# EAGLE design S7G2_footprint_with_caps_v1p0 (EAGLE 9.5.0)
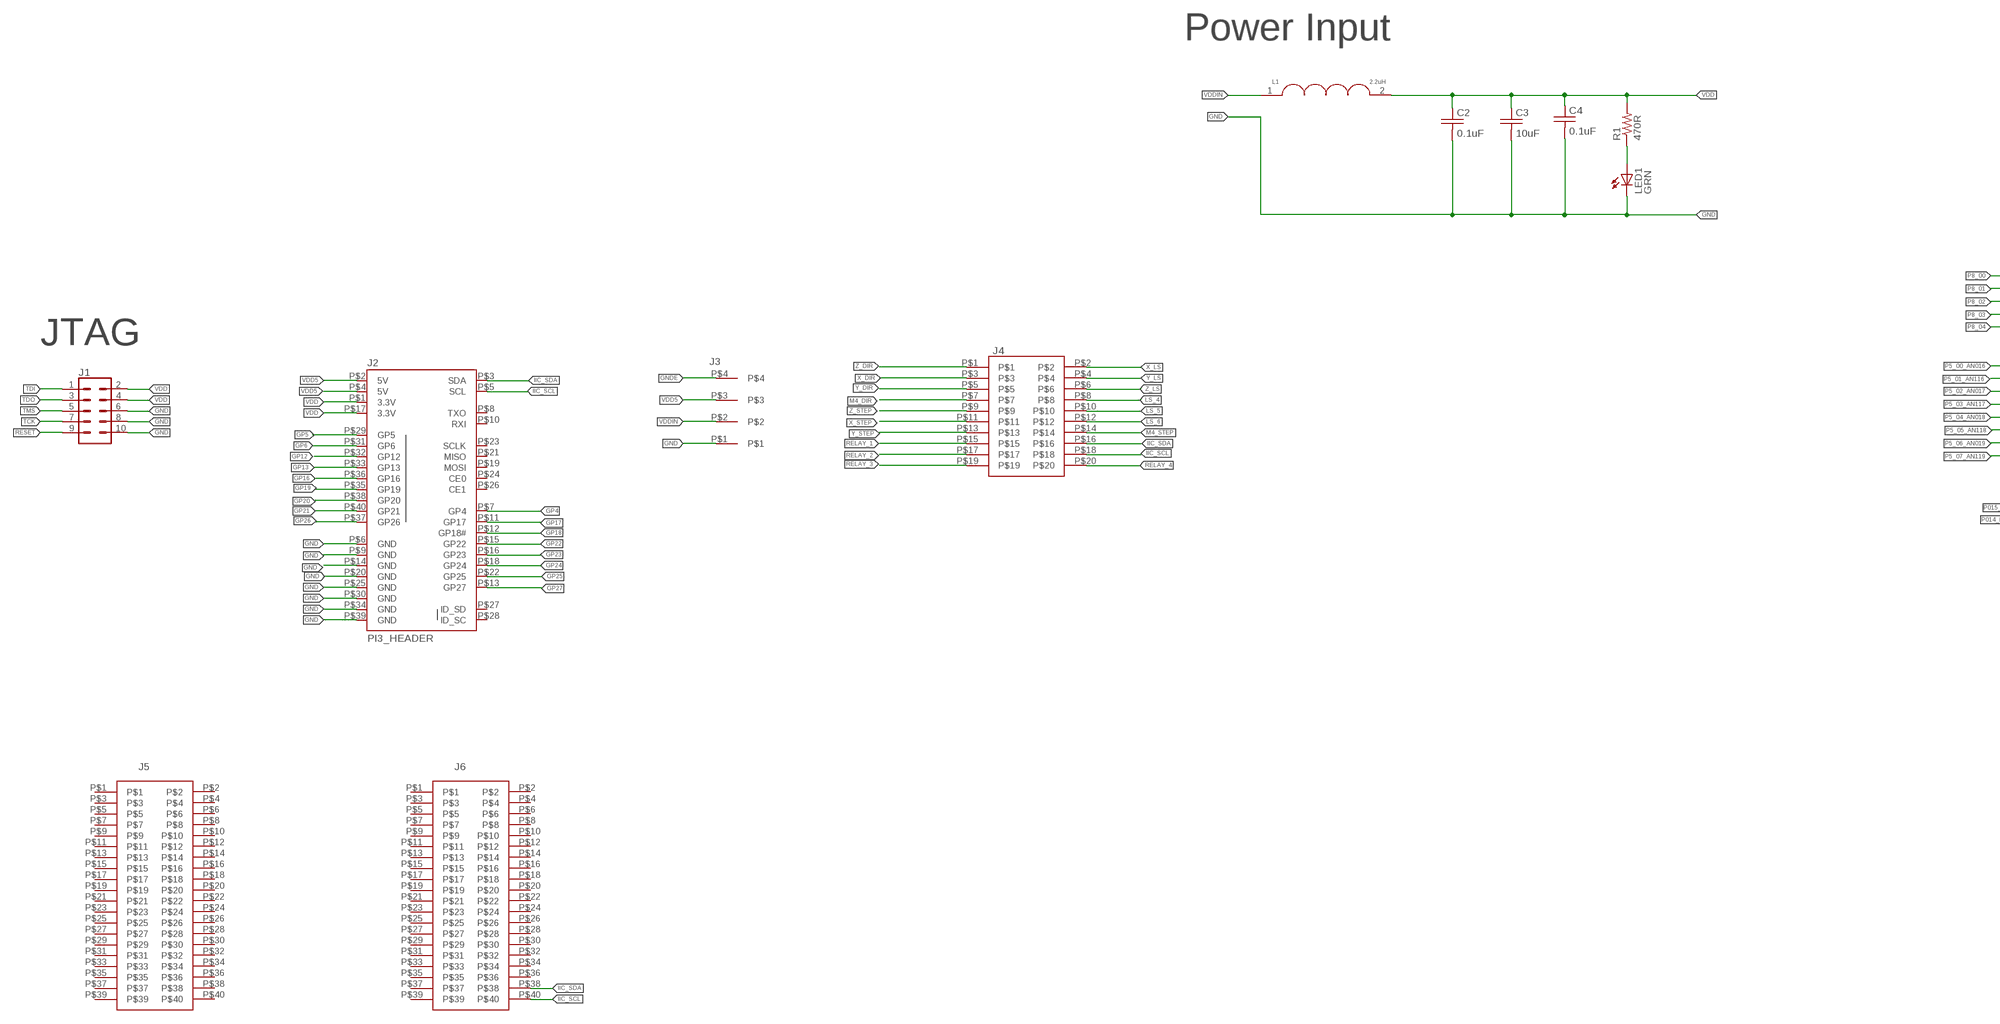
[diagram p0: schematic, sheet 1, part 1 of 3]
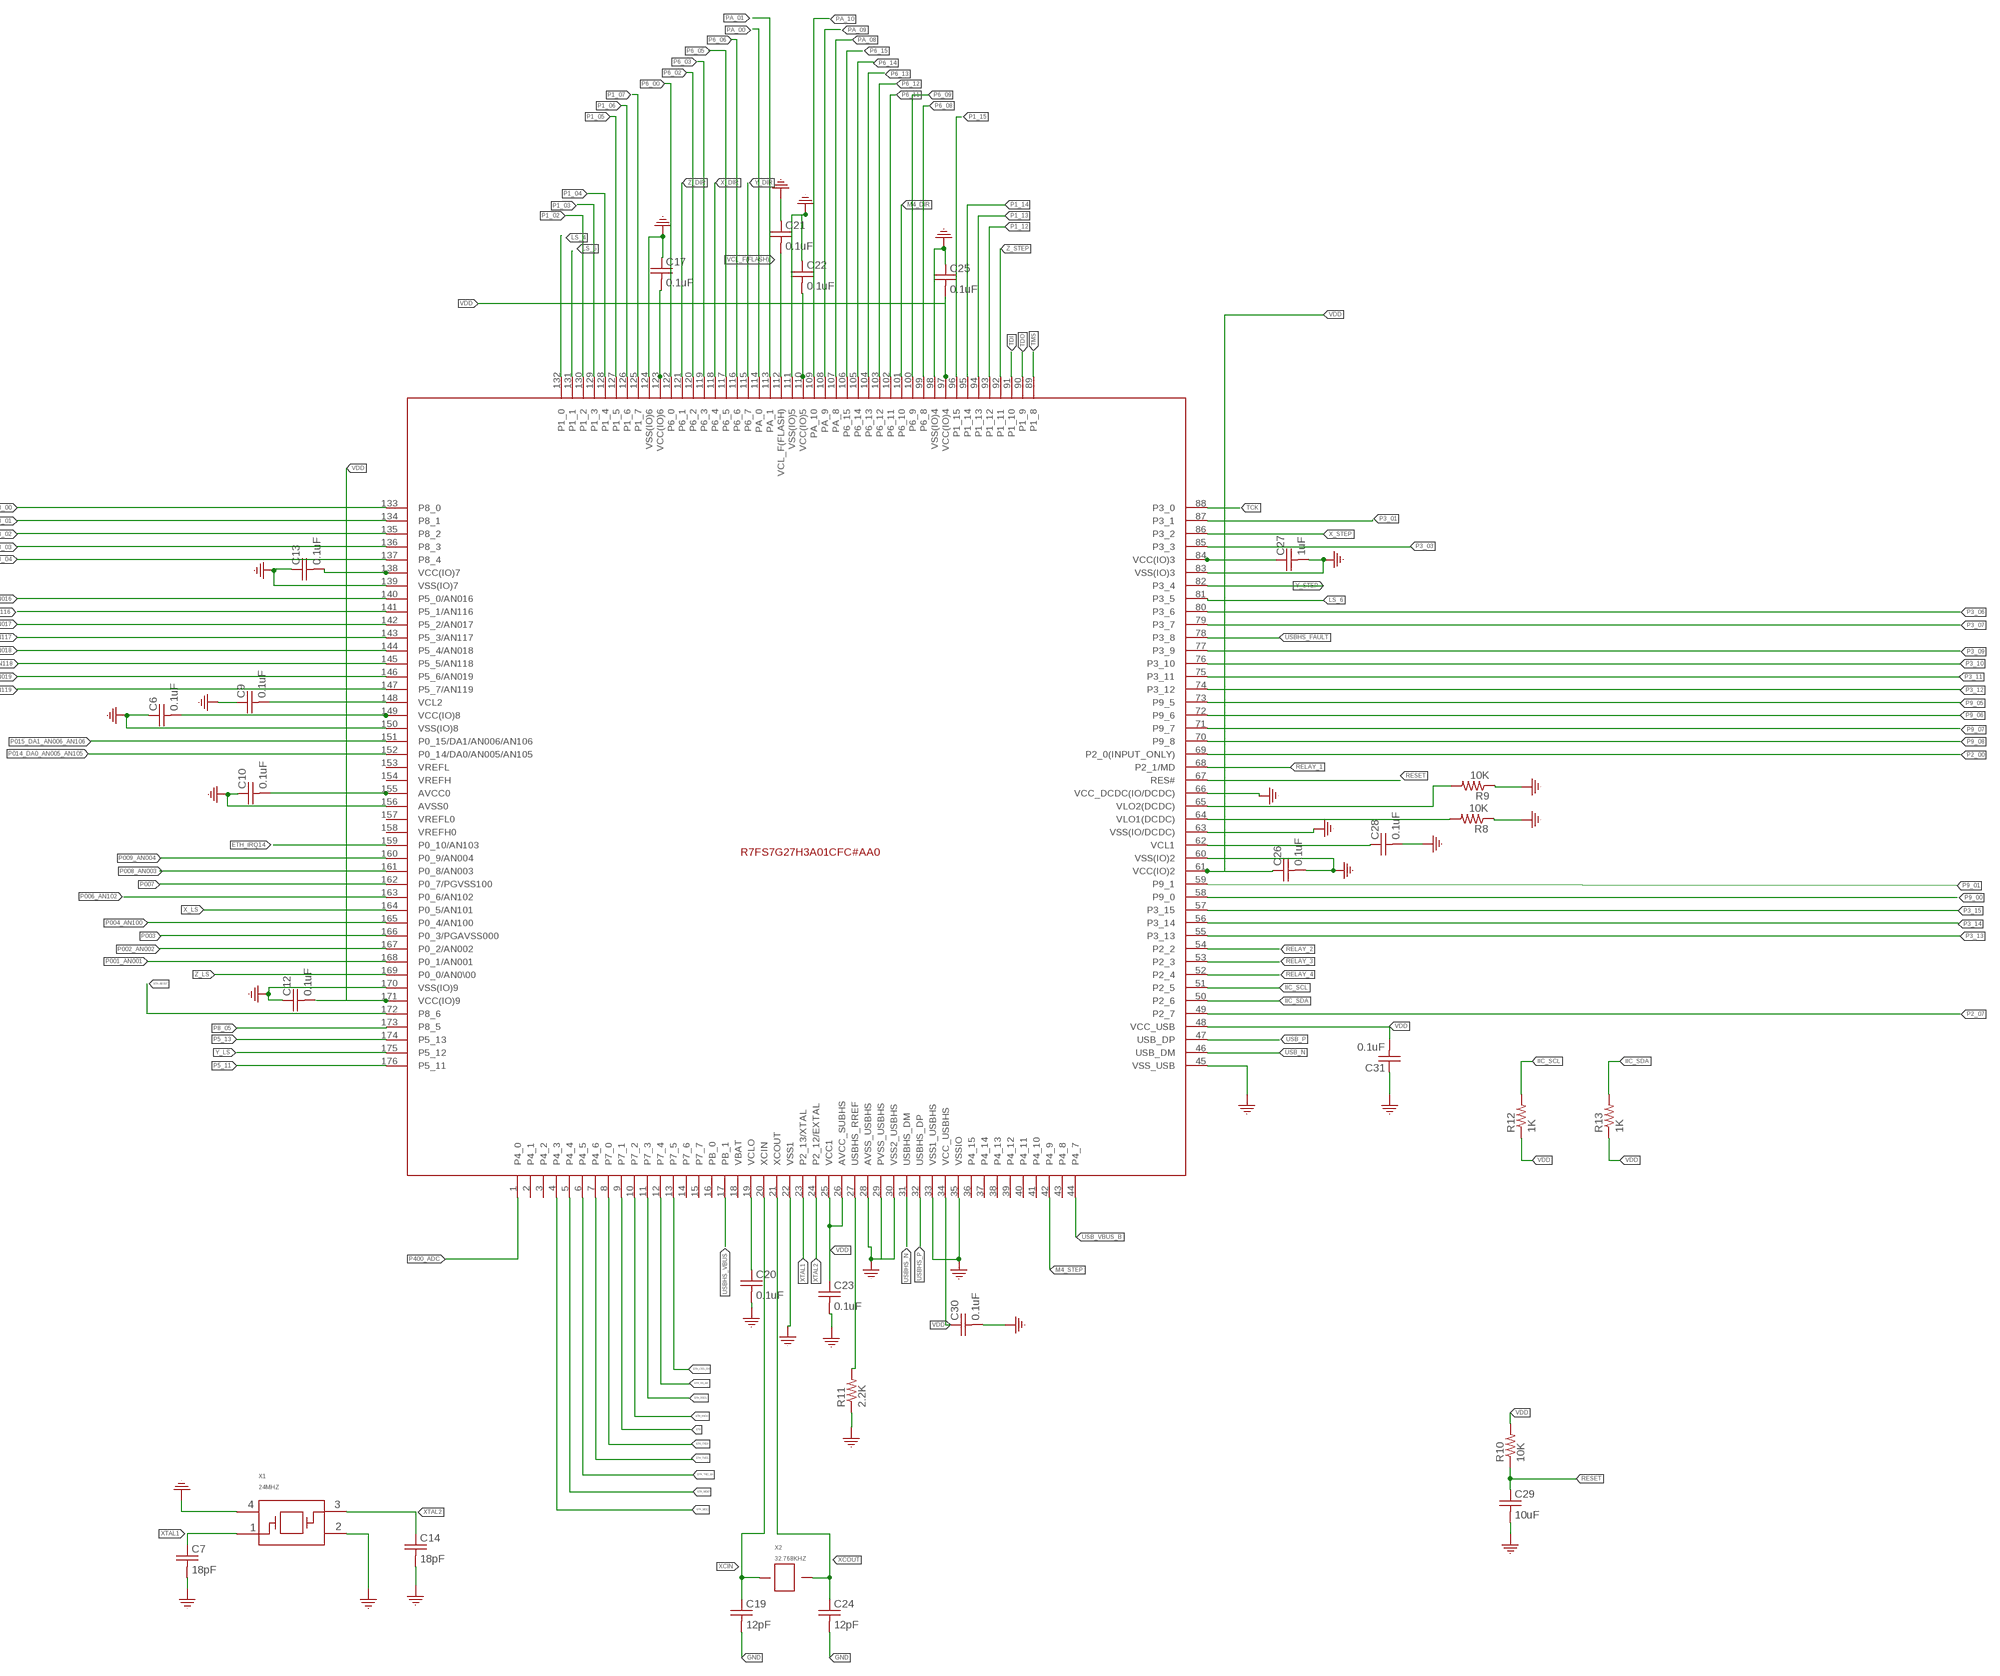
[diagram p1: schematic, sheet 1, part 2 of 3]
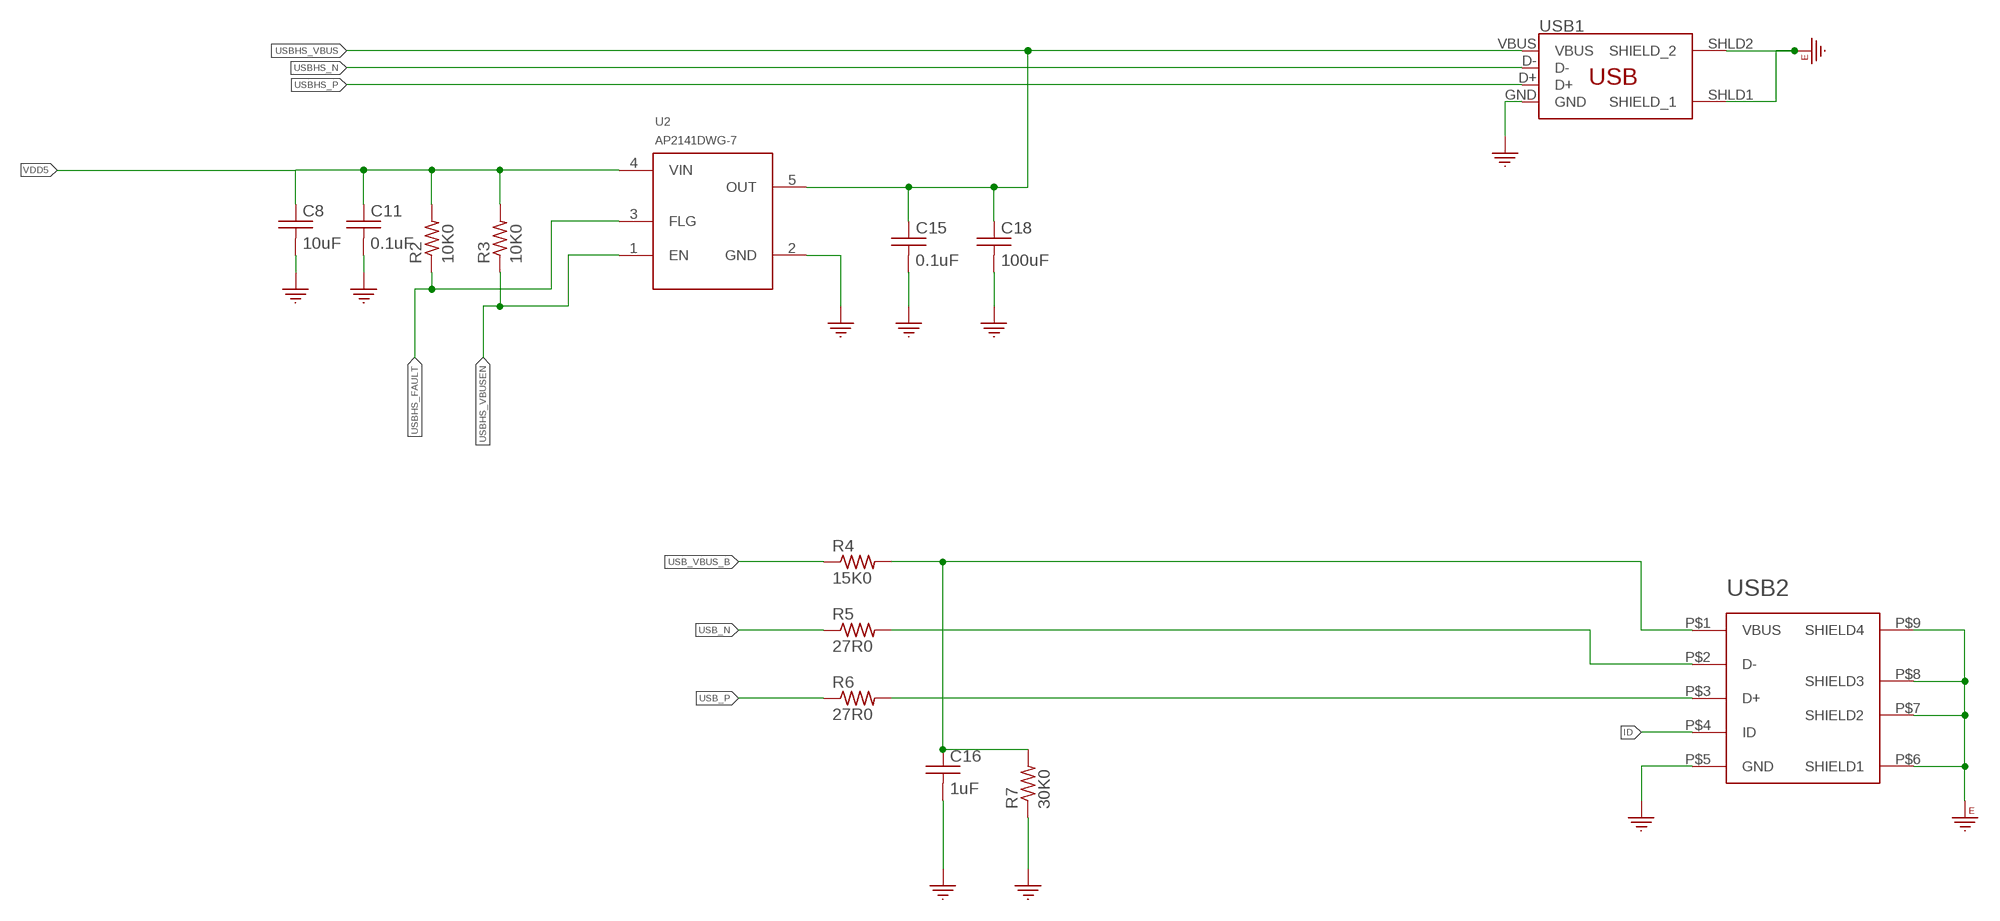
[diagram p2: schematic, sheet 1, part 3 of 3]

## Parts
C2  0.1uF  C_0402  [0402]
C3  10uF  C_0402  [0402]
C4  0.1uF  C_0402  [0402]
C6  0.1uF  C_0402  [0402]
C7  18pF  C_0402  [0402]
C8  10uF  C_0402  [0402]
C9  0.1uF  C_0402  [0402]
C10  0.1uF  C_0402  [0402]
C11  0.1uF  C_0402  [0402]
C12  0.1uF  C_0402  [0402]
C13  0.1uF  C_0402  [0402]
C14  18pF  C_0402  [0402]
C15  0.1uF  C_0402  [0402]
C16  1uF  C_0402  [0402]
C17  0.1uF  C_0402  [0402]
C18  100uF  C_1210  [C1210]
C19  12pF  C_0402  [0402]
C20  0.1uF  C_0402  [0402]
C21  0.1uF  C_0402  [0402]
C22  0.1uF  C_0402  [0402]
C23  0.1uF  C_0402  [0402]
C24  12pF  C_0402  [0402]
C25  0.1uF  C_0402  [0402]
C26  0.1uF  C_0402  [0402]
C27  1uF  C_0402  [0402]
C28  0.1uF  C_0402  [0402]
C29  10uF  C_0402  [0402]
C30  0.1uF  C_0402  [0402]
C31  0.1uF  C_0402  [0402]
J1  CONN_05X2PTH  [2X5]
J2  PI3_HEADER  [HEADER_2_X_20_.1_INCH]
J3  3.81MM_1_X_4_RT_ANGLE_PLUG_HEADER  [1X4_3.81MM_PITCH]
J4  2_X_10_HEADER_GENERIC  [2_X_10_.1_INCH]
J5  HEADER_2_X_20_GENERIC  [HEADER_2_X_20_.1_INCH]
J6  HEADER_2_X_20_GENERIC  [HEADER_2_X_20_.1_INCH]
L1  2.2uH  INDUCTOR_1008_2.2_MH_1.3A  [1008_(2520_METRIC)]
LED1  LED_0805_GREEN  [LED_0805_GREEN]
R1  470R  R_0402  [0402]
R2  10K0  R_0402  [0402]
R3  10K0  R_0402  [0402]
R4  15K0  R_0402  [0402]
R5  27R0  R_0402  [0402]
R6  27R0  R_0402  [0402]
R7  30K0  R_0402  [0402]
R8  10K  R_0402  [0402]
R9  10K  R_0402  [0402]
R10  10K  R_0402  [0402]
R11  2.2K  R_0402  [0402]
R12  1K  R_0402  [0402]
R13  1K  R_0402  [0402]
U2  AP2141DWG-5  [SOT-23-5]
U5  S7G2_X_176  [LQFP176_24X24]
USB1  USB_A  [USB_A_SMT]
USB2  USB_MICRO-B  [USB_MICRO-B]
X1  24MHZ  XTAL_24_MHZ  [SMD_3225]
X2  32.768KHZ  XTAL_32.768KHZ  [SMD_X_2_PADS]

## Nets
D+: R6.P$2 USB2.P$3(D+)
D-: R5.P$2 USB2.P$2(D-)
ETH: U5.9(P7_1)
ETH_CRS_DV: U5.13(P7_5)
ETH_IRQ14: U5.159(P0_10/AN103)
ETH_MDC: U5.4(P4_3)
ETH_MDIO: U5.5(P4_4)
ETH_RESET: U5.172(P8_6)
ETH_RX_ER: U5.12(P7_4)
ETH_RXD0: U5.10(P7_2)
ETH_RXD1: U5.11(P7_3)
ETH_TXD0: U5.8(P7_0)
ETH_TXD1: U5.7(P4_6)
ETH_TXD_EN: U5.6(P4_5)
GND: C2.P$2 C3.P$2 C4.P$2 C6.P$1 C7.P$2 C8.P$2 C9.P$1 C10.P$1 C11.P$2 C12.P$1 C13.P$1 C14.P$2 C15.P$2 C16.P$2 C17.P$1 C18.2 C19.P$2 C20.P$2 C21.P$1 C22.P$1 C23.P$2 C24.P$2 C25.P$1 C26.P$2 C27.P$2 C28.P$2 C29.P$2 C30.P$2 C31.P$1 J1.6 J1.8 J1.10 J2.P$6(GND) J2.P$9(GND) J2.P$14(GND) J2.P$20(GND) J2.P$25(GND) J2.P$30(GND) J2.P$34(GND) J2.P$39(GND) J3.P$1 LED1.C R7.P$1 R8.P$1 R9.P$1 R11.P$1 U2.2(GND) U5.22(VSS1) U5.28(AVSS_USBHS) U5.29(PVSS_USBHS) U5.30(VSS2_USBHS) U5.33(VSS1_USBHS) U5.35(VSSIO) U5.45(VSS_USB) U5.60(VSS(IO)2) U5.63(VSS(IO/DCDC)) U5.66(VCC_DCDC(IO/DCDC)) U5.83(VSS(IO)3) U5.98(VSS(IO)4) U5.111(VSS(IO)5) U5.124(VSS(IO)6) U5.139(VSS(IO)7) U5.150(VSS(IO)8) U5.156(AVSS0) U5.170(VSS(IO)9) USB1.GND USB2.P$5(GND) X1.2 X1.4
GNDE: J3.P$4 USB1.SHLD1(SHIELD_1) USB1.SHLD2(SHIELD_2) USB2.P$6(SHIELD1) USB2.P$7(SHIELD2) USB2.P$8(SHIELD3) USB2.P$9(SHIELD4)
GP4: J2.P$7(GP4)
GP5: J2.P$29(GP5)
GP6: J2.P$31(GP6)
GP12: J2.P$32(GP12)
GP13: J2.P$33(GP13)
GP16: J2.P$36(GP16)
GP17: J2.P$11(GP17)
GP18: J2.P$12(GP18#)
GP19: J2.P$35(GP19)
GP20: J2.P$38(GP20)
GP21: J2.P$40(GP21)
GP22: J2.P$15(GP22)
GP23: J2.P$16(GP23)
GP24: J2.P$18(GP24)
GP25: J2.P$22(GP25)
GP26: J2.P$37(GP26)
GP27: J2.P$13(GP27)
ID: USB2.P$4(ID)
IIC_SCL: J2.P$5(SCL) J4.P$18 J6.P$40 R12.P$2 U5.51(P2_5)
IIC_SDA: J2.P$3(SDA) J4.P$16 J6.P$38 R13.P$2 U5.50(P2_6)
LS_4: J4.P$8 U5.132(P1_0)
LS_5: J4.P$10 U5.131(P1_1)
LS_6: J4.P$12 U5.81(P3_5)
M4_DIR: J4.P$7 U5.101(P6_10)
M4_STEP: J4.P$14 U5.42(P4_9)
N$2: R11.P$2 U5.27(USBHS_RREF)
N$7: LED1.A R1.P$1
N$9: C9.P$2 U5.148(VCL2)
N$14: C20.P$1 U5.19(VCLO)
N$17: C28.P$1 U5.62(VCL1)
N$18: R8.P$2 U5.64(VLO1(DCDC))
N$19: R9.P$2 U5.65(VLO2(DCDC))
P1_02: U5.130(P1_2)
P1_03: U5.129(P1_3)
P1_04: U5.128(P1_4)
P1_05: U5.127(P1_5)
P1_06: U5.126(P1_6)
P1_07: U5.125(P1_7)
P1_12: U5.93(P1_12)
P1_13: U5.94(P1_13)
P1_14: U5.95(P1_14)
P1_15: U5.96(P1_15)
P001_AN001: U5.168(P0_1/AN001)
P2_00: U5.69(P2_0(INPUT_ONLY))
P2_07: U5.49(P2_7)
P002_AN002: U5.167(P0_2/AN002)
P003: U5.166(P0_3/PGAVSS000)
P3_01: U5.87(P3_1)
P3_03: U5.85(P3_3)
P3_06: U5.80(P3_6)
P3_07: U5.79(P3_7)
P3_09: U5.77(P3_9)
P3_10: U5.76(P3_10)
P3_11: U5.75(P3_11)
P3_12: U5.74(P3_12)
P3_13: U5.55(P3_13)
P3_14: U5.56(P3_14)
P3_15: U5.57(P3_15)
P004_AN100: U5.165(P0_4/AN100)
P5_00_AN016: U5.140(P5_0/AN016)
P5_01_AN116: U5.141(P5_1/AN116)
P5_02_AN017: U5.142(P5_2/AN017)
P5_03_AN117: U5.143(P5_3/AN117)
P5_04_AN018: U5.144(P5_4/AN018)
P5_05_AN118: U5.145(P5_5/AN118)
P5_06_AN019: U5.146(P5_6/AN019)
P5_07_AN119: U5.147(P5_7/AN119)
P5_11: U5.176(P5_11)
P5_13: U5.174(P5_13)
P6_00: U5.122(P6_0)
P6_02: U5.120(P6_2)
P6_03: U5.119(P6_3)
P6_05: U5.117(P6_5)
P6_06: U5.116(P6_6)
P6_08: U5.99(P6_8)
P6_09: U5.100(P6_9)
P6_11: U5.102(P6_11)
P6_12: U5.103(P6_12)
P6_13: U5.104(P6_13)
P6_14: U5.105(P6_14)
P6_15: U5.106(P6_15)
P006_AN102: U5.163(P0_6/AN102)
P007: U5.162(P0_7/PGVSS100)
P8_00: U5.133(P8_0)
P8_01: U5.134(P8_1)
P8_02: U5.135(P8_2)
P8_03: U5.136(P8_3)
P8_04: U5.137(P8_4)
P8_05: U5.173(P8_5)
P008_AN003: U5.161(P0_8/AN003)
P9_00: U5.58(P9_0)
P9_01: U5.59(P9_1)
P9_05: U5.73(P9_5)
P9_06: U5.72(P9_6)
P9_07: U5.71(P9_7)
P9_08: U5.70(P9_8)
P009_AN004: U5.160(P0_9/AN004)
P014_DA0_AN005_AN105: U5.152(P0_14/DA0/AN005/AN105)
P015_DA1_AN006_AN106: U5.151(P0_15/DA1/AN006/AN106)
P400_ADC: U5.1(P4_0)
P706: U5.14(P7_6)
PA_00: U5.114(PA_0)
PA_01: U5.113(PA_1)
PA_08: U5.107(PA_8)
PA_09: U5.108(PA_9)
PA_10: U5.109(PA_10)
RELAY_1: J4.P$15 U5.68(P2_1/MD)
RELAY_2: J4.P$17 U5.54(P2_2)
RELAY_3: J4.P$19 U5.53(P2_3)
RELAY_4: J4.P$20 U5.52(P2_4)
RESET: C29.P$1 J1.9 R10.P$1 U5.67(RES#)
TCK: J1.7 U5.88(P3_0)
TDI: J1.1 U5.91(P1_10)
TDO: J1.3 U5.90(P1_9)
TMS: J1.5 U5.89(P1_8)
USB_N: R5.P$1 U5.46(USB_DM)
USB_P: R6.P$1 U5.47(USB_DP)
USB_VBUS_B: R4.P$1 U5.44(P4_7)
USBHS_FAULT: R2.P$1 U2.3(FLG) U5.78(P3_8)
USBHS_N: U5.31(USBHS_DM) USB1.D-
USBHS_P: U5.32(USBHS_DP) USB1.D+
USBHS_VBUS: C15.P$1 C18.1 U2.5(OUT) U5.17(PB_1) USB1.VBUS
USBHS_VBUSEN: R3.P$1 U2.1(EN)
VBUS: C16.P$1 R4.P$2 R7.P$2 USB2.P$1(VBUS)
VCL_F(FLASH): C21.P$2 U5.112(VCL_F(FLASH))
VDD: C2.P$1 C3.P$1 C4.P$1 C6.P$2 C10.P$2 C12.P$2 C13.P$2 C17.P$2 C22.P$2 C23.P$1 C25.P$2 C26.P$1 C27.P$1 C30.P$1 C31.P$2 J1.2 J1.4 J2.P$1(3.3V) J2.P$17(3.3V) L1.2 R1.P$2 R10.P$2 R12.P$1 R13.P$1 U5.25(VCC1) U5.26(AVCC_SUBHS) U5.34(VCC_USBHS) U5.48(VCC_USB) U5.61(VCC(IO)2) U5.84(VCC(IO)3) U5.97(VCC(IO)4) U5.110(VCC(IO)5) U5.123(VCC(IO)6) U5.138(VCC(IO)7) U5.149(VCC(IO)8) U5.155(AVCC0) U5.171(VCC(IO)9)
VDD5: C8.P$1 C11.P$1 J2.P$2(5V) J2.P$4(5V) J3.P$3 R2.P$2 R3.P$2 U2.4(VIN)
VDDIN: J3.P$2 L1.1
X_DIR: J4.P$3 U5.118(P6_4)
X_LS: J4.P$2 U5.164(P0_5/AN101)
X_STEP: J4.P$11 U5.86(P3_2)
XCIN: C19.P$1 U5.20(XCIN) X2.P$1
XCOUT: C24.P$1 U5.21(XCOUT) X2.P$2
XTAL1: C7.P$1 U5.23(P2_13/XTAL) X1.1
XTAL2: C14.P$1 U5.24(P2_12/EXTAL) X1.3
Y_DIR: J4.P$5 U5.115(P6_7)
Y_LS: J4.P$4 U5.175(P5_12)
Y_STEP: J4.P$13 U5.82(P3_4)
Z_DIR: J4.P$1 U5.121(P6_1)
Z_LS: J4.P$6 U5.169(P0_0/AN0\00)
Z_STEP: J4.P$9 U5.92(P1_11)
Unconnected: J2.P$8(TXO) J2.P$10(RXI) J2.P$19(MOSI) J2.P$21(MISO) J2.P$23(SCLK) J2.P$24(CE0) J2.P$26(CE1) J2.P$27(ID_SD) J2.P$28(ID_SC) J5.P$1 J5.P$2 J5.P$3 J5.P$4 J5.P$5 J5.P$6 J5.P$7 J5.P$8 J5.P$9 J5.P$10 J5.P$11 J5.P$12 J5.P$13 J5.P$14 J5.P$15 J5.P$16 J5.P$17 J5.P$18 J5.P$19 J5.P$20 J5.P$21 J5.P$22 J5.P$23 J5.P$24 J5.P$25 J5.P$26 J5.P$27 J5.P$28 J5.P$29 J5.P$30 J5.P$31 J5.P$32 J5.P$33 J5.P$34 J5.P$35 J5.P$36 J5.P$37 J5.P$38 J5.P$39 J5.P$40 J6.P$1 J6.P$2 J6.P$3 J6.P$4 J6.P$5 J6.P$6 J6.P$7 J6.P$8 J6.P$9 J6.P$10 J6.P$11 J6.P$12 J6.P$13 J6.P$14 J6.P$15 J6.P$16 J6.P$17 J6.P$18 J6.P$19 J6.P$20 J6.P$21 J6.P$22 J6.P$23 J6.P$24 J6.P$25 J6.P$26 J6.P$27 J6.P$28 J6.P$29 J6.P$30 J6.P$31 J6.P$32 J6.P$33 J6.P$34 J6.P$35 J6.P$36 J6.P$37 J6.P$39 U5.2(P4_1) U5.3(P4_2) U5.15(P7_7) U5.16(PB_0) U5.18(VBAT) U5.36(P4_15) U5.37(P4_14) U5.38(P4_13) U5.39(P4_12) U5.40(P4_11) U5.41(P4_10) U5.43(P4_8) U5.153(VREFL) U5.154(VREFH) U5.157(VREFL0) U5.158(VREFH0)

## Notes on the sheet
- Power Input
- JTAG

## Library data of the parts
C2-C4 C6-C17 C19-C31 = 3D_MIG_Controller:C_0402
C18 = 3D_MIG_Controller:C_1210
J1 = 3D_MIG_Controller:CONN_05X2: Multi connection point. Often used as Generic Header-pin footprint for 0.1 inch spaced/style header connections For AVR SPI programming port, see special device with nice symbol: "AVR_SPI_PROG_5x2.dev" You can populate with any combo of single row headers, but if you'd like an exact match, check these: 2x5 AVR ICSP Male Header <https://www.sparkfun.com/products/778> (PRT-00778) 2x5 Pin Shrouded Header <https://www.sparkfun.com/products/8506> (PRT-08506) On any of the 0.1 inch spaced packages, you can populate with these: Break Away Headers - Straight <https://www.sparkfun.com/products/116> (PRT-00116) Break Away Male Headers - Right Angle <https://www.sparkfun.com/products/553> (PRT-00553) Female Headers <https://www.sparkfun.com/products/115> (PRT-00115) Break Away Headers - Machine Pin <https://www.sparkfun.com/products/117> (PRT-00117) Break Away Female Headers - Swiss Machine Pin <https://www.sparkfun.com/products/743> (PRT-00743) Special note: the shrouded connector mates well with our 5x2 ribbon cables: 2x5 Pin IDC Ribbon Cable <https://www.sparkfun.com/products/8535> (PRT-08535); PROD_ID: CONN-08499; SF_ID: PRT-0778
J2 = 3D_MIG_Controller:PI3_HEADER
J3 = 3D_MIG_Controller:3.81MM_1_X_4_RT_ANGLE_PLUG_HEADER
J4 = 3D_MIG_Controller:2_X_10_HEADER_GENERIC
J5 J6 = 3D_MIG_Controller:HEADER_2_X_20_GENERIC
L1 = 3D_MIG_Controller:INDUCTOR_1008_2.2_MH_1.3A
LED1 = 3D_MIG_Controller:LED_0805_GREEN
R1-R13 = 3D_MIG_Controller:R_0402
U2 = 3D_MIG_Controller:AP2141DWG-5
U5 = 3D_MIG_Controller:S7G2_X_176
USB1 = 3D_MIG_Controller:USB_A: USB-A Connector Male and female variants, as well as PTH and SMT variants SparkFun Products: SparkFun XBee Explorer Dongle <https://www.sparkfun.com/products/11697> PTH Male SparkFun MicroView-USB Programmer <https://www.sparkfun.com/products/12924> SMT Male SparkFun USB Type A Female Breakout <https://www.sparkfun.com/products/12700> SMT Female
USB2 = 3D_MIG_Controller:USB_MICRO-B
X1 = 3D_MIG_Controller:XTAL_24_MHZ
X2 = 3D_MIG_Controller:XTAL_32.768KHZ

## Board
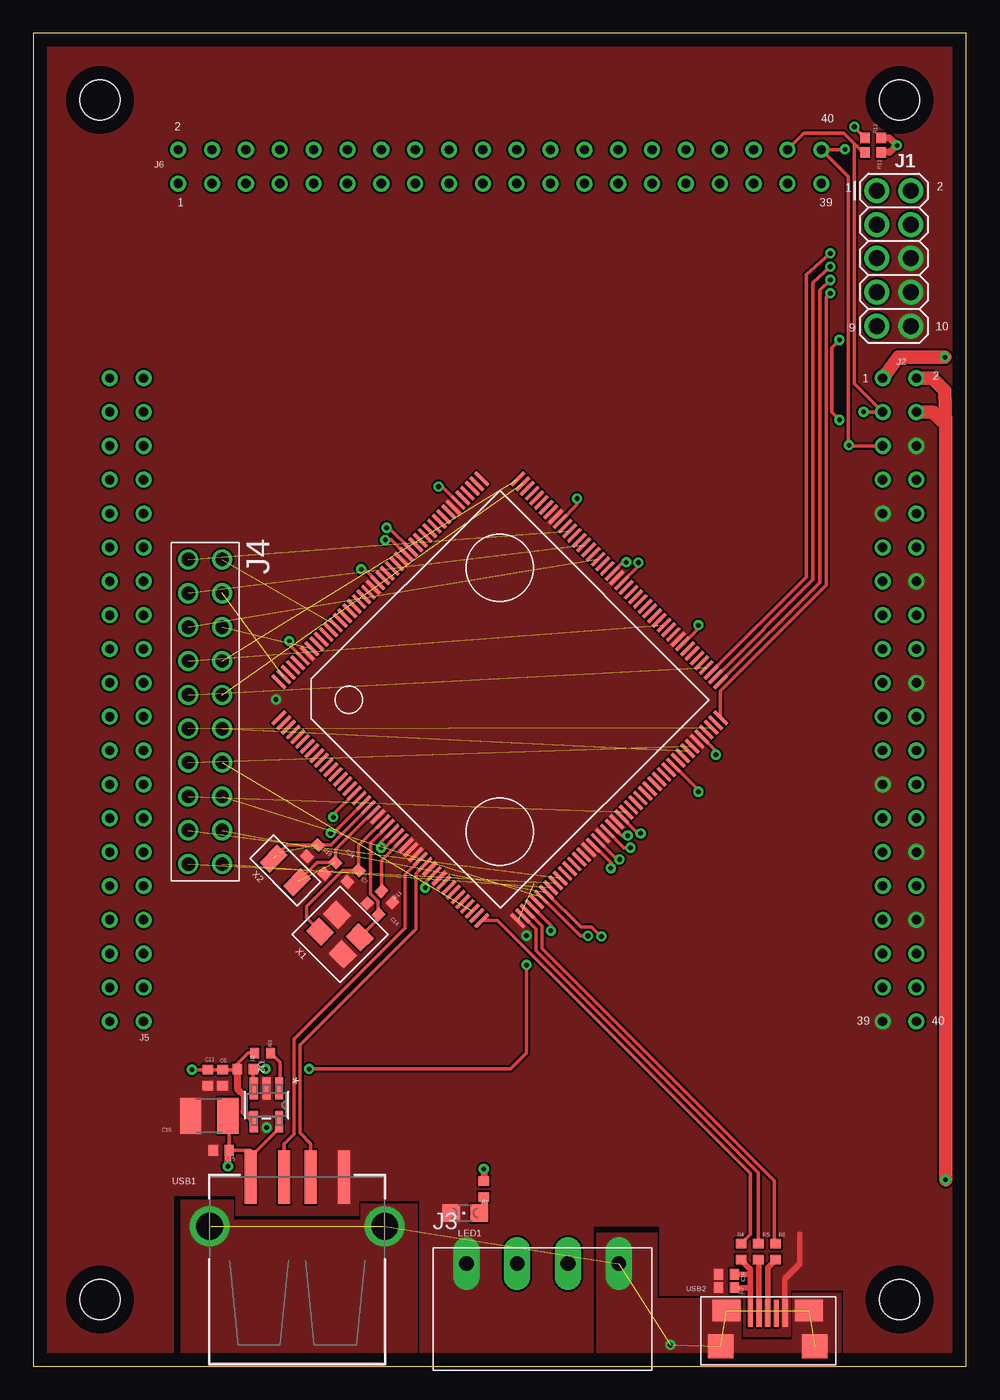
[diagram p3: board, top side]
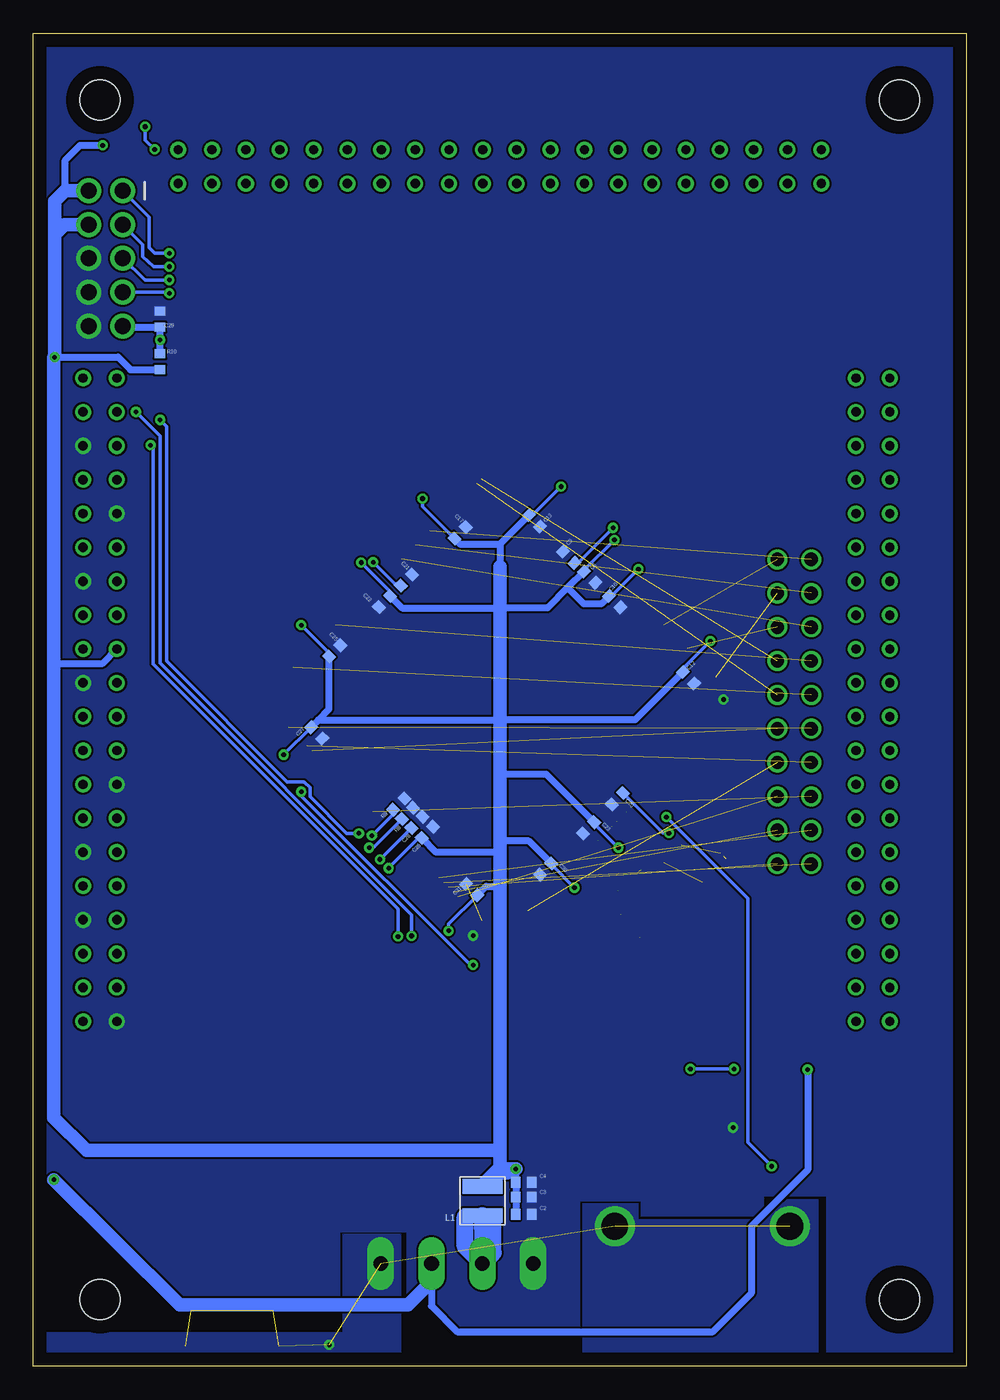
[diagram p4: board, bottom side, seen from below]

Size 70 x 100 mm. Coordinates in mm from the lower left corner, seen from the top.
Outline: 0,0 70,0 70,100 0,100 0,0
Copper layers (1*16): Top 0.035mm / dielectric 1.5mm / Bottom 0.035mm
Design rules "default": minimum track width 6mil, minimum drill 0.35mm, track to track 6mil, track to pad 6mil, pad to pad 6mil, via to via 6mil, smd to smd 6mil, copper to edge 40mil, drill to drill 6mil, minimum pad ring 10mil, minimum via ring 8mil, stop-mask expansion 4mil, vias tented up to drill 0mil, thermal gap 10mil
Holes 3 mm at 5,95 65,95 65,5 5,5

### Footprints (pad centres in the part's own frame; a part is rotated, then mirrored left to right if it is on the bottom)
0402 = smd 0.8 x 0.7: P$1 0,0.6; P$2 0,-0.6
C1210 = smd 1.6 x 2.7: 1 -1.4,0; 2 1.4,0
2X5 = drill 1.2 pad 1.88: 1 0,0; 2 0,2.54; 3 2.54,0; 4 2.54,2.54; 5 5.08,0; 6 5.08,2.54; 7 7.62,0; 8 7.62,2.54; 9 10.16,0; 10 10.16,2.54
HEADER_2_X_20_.1_INCH = drill 0.7: P$1 -24.13,-1.27; P$2 -24.13,1.27; P$3 -21.59,-1.27; P$4 -21.59,1.27; P$5 -19.05,-1.27; P$6 -19.05,1.27; P$7 -16.51,-1.27; P$8 -16.51,1.27; P$9 -13.97,-1.27; P$10 -13.97,1.27; P$11 -11.43,-1.27; P$12 -11.43,1.27; P$13 -8.89,-1.27; P$14 -8.89,1.27; P$15 -6.35,-1.27; P$16 -6.35,1.27; P$17 -3.81,-1.27; P$18 -3.81,1.27; P$19 -1.27,-1.27; P$20 -1.27,1.27; P$21 1.27,-1.27; P$22 1.27,1.27; P$23 3.81,-1.27; P$24 3.81,1.27; P$25 6.35,-1.27; P$26 6.35,1.27; P$27 8.89,-1.27; P$28 8.89,1.27; P$29 11.43,-1.27; P$30 11.43,1.27; P$31 13.97,-1.27; P$32 13.97,1.27; P$33 16.51,-1.27; P$34 16.51,1.27; P$35 19.05,-1.27; P$36 19.05,1.27; P$37 21.59,-1.27; P$38 21.59,1.27; P$39 24.13,-1.27; P$40 24.13,1.27
1X4_3.81MM_PITCH = drill 1.1 pad 2 long: P$1 0,0; P$2 3.81,0; P$3 7.62,0; P$4 11.43,0
2_X_10_.1_INCH = drill 1: P$1 -11.43,-1.27; P$2 -11.43,1.27; P$3 -8.89,-1.27; P$4 -8.89,1.27; P$5 -6.35,-1.27; P$6 -6.35,1.27; P$7 -3.81,-1.27; P$8 -3.81,1.27; P$9 -1.27,-1.27; P$10 -1.27,1.27; P$11 1.27,-1.27; P$12 1.27,1.27; P$13 3.81,-1.27; P$14 3.81,1.27; P$15 6.35,-1.27; P$16 6.35,1.27; P$17 8.89,-1.27; P$18 8.89,1.27; P$19 11.43,-1.27; P$20 11.43,1.27
1008_(2520_METRIC) = smd 3 x 1.1: 1 0,1.1; 2 0,-1.1
LED_0805_GREEN = smd 1.3 x 1.3: A 0,-1.05; C 0,1.05
SOT-23-5 = smd 1.626 x 0.61: 1 -1.245,0.95; 2 -1.245,0; 3 -1.245,-0.95; 4 1.245,-0.95; 5 1.245,0.95
LQFP176_24X24 = smd 1.372 x 0.254: 1 -12.675,10.75; 2 -12.675,10.25; 3 -12.675,9.75; 4 -12.675,9.25; 5 -12.675,8.75; 6 -12.675,8.25; 7 -12.675,7.75; 8 -12.675,7.25; 9 -12.675,6.75; 10 -12.675,6.25; 11 -12.675,5.75; 12 -12.675,5.25; 13 -12.675,4.75; 14 -12.675,4.25; 15 -12.675,3.75; 16 -12.675,3.25; 17 -12.675,2.75; 18 -12.675,2.25; 19 -12.675,1.75; 20 -12.675,1.25; 21 -12.675,0.75; 22 -12.675,0.25; 23 -12.675,-0.25; 24 -12.675,-0.75; 25 -12.675,-1.25; 26 -12.675,-1.75; 27 -12.675,-2.25; 28 -12.675,-2.75; 29 -12.675,-3.25; 30 -12.675,-3.75; 31 -12.675,-4.25; 32 -12.675,-4.75; 33 -12.675,-5.25; 34 -12.675,-5.75; 35 -12.675,-6.25; 36 -12.675,-6.75; 37 -12.675,-7.25; 38 -12.675,-7.75; 39 -12.675,-8.25; 40 -12.675,-8.75; 41 -12.675,-9.25; 42 -12.675,-9.75; 43 -12.675,-10.25; 44 -12.675,-10.75; 89 12.675,-10.75; 90 12.675,-10.25; 91 12.675,-9.75; 92 12.675,-9.25; 93 12.675,-8.75; 94 12.675,-8.25; 95 12.675,-7.75; 96 12.675,-7.25; 97 12.675,-6.75; 98 12.675,-6.25; 99 12.675,-5.75; 100 12.675,-5.25; 101 12.675,-4.75; 102 12.675,-4.25; 103 12.675,-3.75; 104 12.675,-3.25; 105 12.675,-2.75; 106 12.675,-2.25; 107 12.675,-1.75; 108 12.675,-1.25; 109 12.675,-0.75; 110 12.675,-0.25; 111 12.675,0.25; 112 12.675,0.75; 113 12.675,1.25; 114 12.675,1.75; 115 12.675,2.25; 116 12.675,2.75; 117 12.675,3.25; 118 12.675,3.75; 119 12.675,4.25; 120 12.675,4.75; 121 12.675,5.25; 122 12.675,5.75; 123 12.675,6.25; 124 12.675,6.75; 125 12.675,7.25; 126 12.675,7.75; 127 12.675,8.25; 128 12.675,8.75; 129 12.675,9.25; 130 12.675,9.75; 131 12.675,10.25; 132 12.675,10.75 | smd 0.254 x 1.372: 45 -10.75,-12.675; 46 -10.25,-12.675; 47 -9.75,-12.675; 48 -9.25,-12.675; 49 -8.75,-12.675; 50 -8.25,-12.675; 51 -7.75,-12.675; 52 -7.25,-12.675; 53 -6.75,-12.675; 54 -6.25,-12.675; 55 -5.75,-12.675; 56 -5.25,-12.675; 57 -4.75,-12.675; 58 -4.25,-12.675; 59 -3.75,-12.675; 60 -3.25,-12.675; 61 -2.75,-12.675; 62 -2.25,-12.675; 63 -1.75,-12.675; 64 -1.25,-12.675; 65 -0.75,-12.675; 66 -0.25,-12.675; 67 0.25,-12.675; 68 0.75,-12.675; 69 1.25,-12.675; 70 1.75,-12.675; 71 2.25,-12.675; 72 2.75,-12.675; 73 3.25,-12.675; 74 3.75,-12.675; 75 4.25,-12.675; 76 4.75,-12.675; 77 5.25,-12.675; 78 5.75,-12.675; 79 6.25,-12.675; 80 6.75,-12.675; 81 7.25,-12.675; 82 7.75,-12.675; 83 8.25,-12.675; 84 8.75,-12.675; 85 9.25,-12.675; 86 9.75,-12.675; 87 10.25,-12.675; 88 10.75,-12.675; 133 10.75,12.675; 134 10.25,12.675; 135 9.75,12.675; 136 9.25,12.675; 137 8.75,12.675; 138 8.25,12.675; 139 7.75,12.675; 140 7.25,12.675; 141 6.75,12.675; 142 6.25,12.675; 143 5.75,12.675; 144 5.25,12.675; 145 4.75,12.675; 146 4.25,12.675; 147 3.75,12.675; 148 3.25,12.675; 149 2.75,12.675; 150 2.25,12.675; 151 1.75,12.675; 152 1.25,12.675; 153 0.75,12.675; 154 0.25,12.675; 155 -0.25,12.675; 156 -0.75,12.675; 157 -1.25,12.675; 158 -1.75,12.675; 159 -2.25,12.675; 160 -2.75,12.675; 161 -3.25,12.675; 162 -3.75,12.675; 163 -4.25,12.675; 164 -4.75,12.675; 165 -5.25,12.675; 166 -5.75,12.675; 167 -6.25,12.675; 168 -6.75,12.675; 169 -7.25,12.675; 170 -7.75,12.675; 171 -8.25,12.675; 172 -8.75,12.675; 173 -9.25,12.675; 174 -9.75,12.675; 175 -10.25,12.675; 176 -10.75,12.675
USB_A_SMT = smd 4 x 0.9: D+ 6.7,-1; D- 6.7,1; GND 6.7,-3.5; VBUS 6.7,3.5 | drill 2: SHLD1 3,-6.566; SHLD2 3,6.566
USB_MICRO-B = smd 0.4 x 2: P$1 -1.3,2.475; P$2 -0.65,2.475; P$3 0,2.475; P$4 0.65,2.475; P$5 1.3,2.475 | smd 2.1 x 1.6: P$6 -3.1,2.675; P$7 3.1,2.675 | smd 1.9 x 1.8: P$8 -3.525,0; P$9 3.525,0
SMD_3225 = smd 1.6 x 1.4: 1 -1.2,-0.9; 2 1.2,-0.9; 3 1.2,0.9; 4 -1.2,0.9
SMD_X_2_PADS = smd 1.9 x 1.1: P$1 0,1.25; P$2 0,-1.25

### Placement (x,y rotation side)
C2  33.2,11.4 90 bottom
C3  33.2,12.7 90 bottom
C4  33.2,13.8 90 bottom
C6  28.25,59.2 225 bottom
C7  24,36.77 315 top
C8  14.2,21.65 0 top
C9  29.82,60.69 45 bottom
C10  26.37,57.36 225 bottom
C11  13.1,21.65 0 top
C12  20.84,51.65 225 bottom
C13  32.39,63.43 225 bottom
C14  25.48,34.3 225 top
C15  14.1,16.2 270 top
C16  52,6.9 270 top
C17  37.98,62.53 315 bottom
C18  13.2,18.8 180 top
C19  20.96,38.68 315 top
C20  26.17,42.57 315 bottom
C21  42,58.98 315 bottom
C22  43.65,57.37 135 bottom
C23  28.34,40.39 315 bottom
C24  22.27,37.38 315 top
C25  47.39,53.66 315 bottom
C26  40.43,40.05 135 bottom
C27  48.74,47.51 45 bottom
C28  41.21,40.8 135 bottom
C29  60.5,78.56 180 bottom
C30  31.56,37.3 315 bottom
C31  37.11,35.76 45 bottom
J1  63.3,88.2 270 top
J2  65,50 270 top
J3  32.5,7.7 0 top
J4  12.9,49.1 270 top
J5  7,50 90 top
J6  35,90 0 top
L1  36.3,12.4 180 bottom
LED1  32.4,11.5 90 top
R1  33.8,13.3 180 top
R2  15.9,22.3 270 top
R3  17.2,23.5 270 top
R4  53.1,8.6 0 top
R5  54.4,8.6 0 top
R6  55.7,8.6 0 top
R7  52,5.9 90 top
R8  41.92,41.47 315 bottom
R9  42.57,42.17 315 bottom
R10  60.5,75.36 0 bottom
R11  26.54,35.22 225 top
R12  63.02,92.15 270 top
R13  63.02,91.07 270 top
U2  17.5,19.6 270 top
U5  35,50 45 top
USB1  19.8,7.5 90 top
USB2  55.1,1.5 0 top
X1  23.01,32.39 315 top
X2  18.91,37.2 45 top

### Tracks (layer width: path | path; a pad name or v marks a point on that pad's centre or on a via)
D+
  Top 0.4: USB2.P$3 55.1,7.4 R6.P$2
D-
  Top 0.4: USB2.P$2 54.45,7.95 R5.P$2
GND  (via drill 0.35)  (1 unrouted)
  Top 0.4: USB2.P$5 56.4,6.58 57.5,7.67 57.5,9.9
  other vias: 18.21,50.02 37,32.3 17.5,17.9
  pour Top (no thermals): 0,100 70,100 70,0 60.8,-0.1 60.8,5.7 56.8,5.7 56.8,2.2 53.3,2.2 53.3,5.3 47,5.3 47,10.5 42,10.5 42,0 29,0 29,12.4 24.4,12.4 24.4,11.3 15.2,11.3 15.2,12.8 10.5,12.8 10.5,0 0,0
  pour Bottom (no thermals): 0,100 70,100 70,2.9 47,2.9 47,10.1 42,10.1 42,0 29,0 29,12.4 24.4,12.4 24.4,11.3 15.2,11.3 15.2,12.8 10.5,12.8 10.5,0 0,0
GNDE  (via drill 0.35)  (7 unrouted)
  other vias: 47.8,1.6
  pour Top (no thermals): 11.1,0 11.1,12.5 15,12.5 15,11 24.6,11 24.6,12.2 28.8,12.2 28.8,0
  pour Bottom (no thermals): 11.1,0 11.1,12.5 15,12.5 15,11 24.6,11 24.6,12.2 28.8,12.2 28.8,0
  pour Bottom (no thermals): 42.4,0 42.4,9.9 46.8,9.9 46.8,2.5 69.9,2.5 69.9,0
  pour Top (no thermals): 42.3,0 42.3,10 46.8,10 46.8,5.1 53.1,5.1 53.1,2 57,2 57,5.5 60.6,5.5 60.6,0
IIC_SCL  (via drill 0.35)  (1 unrouted)
  Top 0.254: R12.P$2 61.6,92.97 v61.6,93 | v60.9,91.3 60.87,91.27 J6.P$40 61.15,89.25 61.15,69.15 v61.2,69.1 61.25,69.05 J2.P$5 | U5.51 41.1,32.94 41.89,32.94 42.63,32.2 v42.63,32.23
  Bottom 0.254: v61.6,93 61.6,92 v60.9,91.3 | v42.63,32.23 42.63,34.3 61,52.67 61,68.9 v61.2,69.1
IIC_SDA  (via drill 0.35)  (1 unrouted)
  Top 0.254: 61.6,91.7 61.6,73.72 J2.P$3 v62.3,71.6 | J6.P$38 57.82,92.5 60.8,92.5 61.6,91.7 | R13.P$2 62.23,91.07 61.6,91.7 | U5.50 41.05,32.28 v41.62,32.28
  Bottom 0.254: v41.62,32.28 41.62,33.86 60.5,52.74 60.5,69.8 v62.3,71.6
LS_4  (1 unrouted)
LS_5  (1 unrouted)
LS_6  (1 unrouted)
M4_DIR  (1 unrouted)
M4_STEP  (1 unrouted)
N$2  (3 unrouted)
  Top 0.254: 26.1,35.84 R11.P$2 26.12,37.94 U5.27
N$7
  Top 0.508: R1.P$1 33.8,11.85 LED1.A
N$9  (via drill 0.35)
  Top 0.254: U5.148 26.7,62.9 v26.5,62.9
  Bottom 0.254: v26.5,62.9 29.13,60.27 C9.P$2
N$14  (via drill 0.35)
  Top 0.254: U5.19 22.52,40 v22.3,40
  Bottom 0.254: v22.3,40 22.75,40 C20.P$1
N$17  (via drill 0.35)
  Top 0.254: U5.62 43.8,38.02 v43.99,38.02
  Bottom 0.254: v43.99,38.02 C28.P$1
N$18  (via drill 0.35)
  Top 0.254: U5.64 44.33,38.9 v44.8,38.9
  Bottom 0.254: v44.8,38.9 44.49,38.9 R8.P$2
N$19  (via drill 0.35)
  Top 0.254: U5.65 44.13,39.81 v44.6,39.81
  Bottom 0.254: v44.6,39.81 43,41.41 R9.P$2
RELAY_1  (1 unrouted)
RELAY_2  (1 unrouted)
RELAY_3  (1 unrouted)
RELAY_4  (1 unrouted)
RESET  (via drill 0.35)
  Top 0.152: v60.49,77 59.89,76.4
  Top 0.254: v60.49,71 59.91,71.59 59.91,76.41 v60.49,77 | v45.58,39.98 45.38,39.98 U5.67
  Bottom 0.152: v60.49,77 v60.5,77.01 C29.P$1
  Bottom 0.254: v60.49,71 60,70.51 60,52.9 50.95,43.85 49.69,43.85 49.24,43.4 49.24,42.74 46.48,39.98 v45.58,39.98
  Bottom 0.508: R10.P$1 C29.P$1 | C29.P$1 | J1.9 63.22,77.96 C29.P$1
TCK  (via drill 0.35)
  Top 0.254: U5.88 51.56,50.66 59.5,58.6 59.5,80.2 v59.8,80.5
  Bottom 0.254: v59.8,80.5 59.9,80.6 63.28,80.6 J1.7
TDI  (via drill 0.35)
  Top 0.254: U5.91 58,59.21 58,81.9 v59.8,83.5
  Bottom 0.254: J1.1 61.3,86.2 61.3,83.9 60.9,83.5 v59.8,83.5
TDO  (via drill 0.35)
  Top 0.254: U5.90 58.5,59 58.5,81.3 v59.8,82.5
  Bottom 0.254: J1.3 61.8,84.16 61.8,83.26 60.95,82.5 v59.8,82.5
TMS  (via drill 0.35)
  Top 0.254: U5.89 59,58.8 59,80.72 v59.8,81.5
  Bottom 0.254: J1.5 61.6,81.5 v59.8,81.5
USB_N
  Top 0.254: R5.P$1 54.4,14.5 37.71,31.19 37.71,32.79 U5.46
USB_P
  Top 0.254: R6.P$1 55.6,9.3 55.6,13.91 38.17,31.34 38.17,33.04 U5.47
USB_VBUS_B
  Top 0.254: R4.P$1 53.81,9.91 53.81,14.47 34.84,33.44 U5.44
USBHS_FAULT  (via drill 0.35)
  Top 0.254: U2.3 16.5,20.89 R2.P$1 v17.42,22.3 | v49.9,43.1 49.9,43.23 U5.78 | v37,30.1 37,23.5 35.8,22.3 v20.7,22.3
  Bottom 0.254: v17.42,22.3 v20.7,22.3 | v37,30.1 37.2,30.1 49.9,42.8 v49.9,43.1
USBHS_N
  Top 0.254: USB1.D- 18.8,16.7 19.55,17.45 19.55,24.55 27.9,32.9 27.9,36.89 U5.31
USBHS_P
  Top 0.254: U5.32 28.7,36.98 28.7,32.8 20,24.1 20,17.5 20.8,16.7 USB1.D+
USBHS_VBUS  (via drill 0.35)
  Top 0.254: U2.5 18.45,17.86 16.3,15.71 | 16.3,15.71 16.3,16.2 C15.P$1 14.7,16.4 14.7,18.7 C18.1 | 16.3,15.71 USB1.VBUS | U5.17 22.5,41.39 v22.5,41.2
  Top 0.508: U2.5 18.5,18.3 | v14.6,15 14.6,16.3 14.7,16.4
  Bottom 0.254: v22.5,41.2 16.4,35.1 16.4,16.8 v14.6,15
USBHS_VBUSEN
  Top 0.254: R3.P$1 18.5,22.8 18.5,20.89 U2.1
VBUS
  Top 0.4: USB2.P$1 53.8,5.9 | 53.8,5.9 53.8,6.9 | 53.8,6.9 53.8,7.28 53.1,7.97 R4.P$2 | R7.P$2 53.8,5.9 | C16.P$1 53.8,6.9
VCL_F(FLASH)  (via drill 0.35)
  Top 0.254: U5.112 44.26,60.32 v44.49,60.32
  Bottom 0.254: v44.49,60.32 42.73,58.56 C21.P$2
VDD  (via drill 0.35)
  Top 0.254: U5.61 43.34,37.78 v43.34,37.37 | U5.84 51.22,46.15 v51.22,45.88 | U5.97 49.9,55.35 v49.9,55.6 | U5.110 45.4,60.05 v45.4,60.3 | U5.123 40.8,64.64 v40.8,65.1 | U5.138 30.67,66 v30.4,66 | U5.149 27.95,60.91 26.85,62.01 26.42,62.01 v26.4,61.99 | U5.155 24.85,59.8 v24.6,59.8 | U5.171 19.2,54.13 v19.2,54.4 | U5.25 26.1,39.33 v26.1,38.9 26.38,38.9 U5.26 | U5.34 29.4,36.27 v29.4,35.9 | U5.48 38.84,33.08 v38.84,32.66
  Top 0.508: v33.8,14.8 R1.P$2 | R13.P$1 64.27,91.07 v64.8,91.6 64.25,92.15 R12.P$1
  Top 1.016: v68.4,75.7 64.89,75.7 63.76,74.16 J2.P$1
  Bottom 0.254: v43.34,37.37 41.08,39.62 C26.P$1 | v51.22,45.88 C27.P$1 | v49.9,55.6 47.81,53.51 C25.P$2 | v45.4,60.3 43.22,58.12 C22.P$2 | v40.8,65.1 40.8,64.5 C17.P$2 | v30.4,66 32.55,63.85 C13.P$2 | v26.4,61.99 28.68,59.71 C6.P$2 | v24.6,59.8 26.61,57.79 C10.P$2 | v19.2,54.4 21.27,52.34 C12.P$2 | v26.1,38.9 27.91,40.72 C23.P$1 | v29.4,35.9 31.13,37.63 C30.P$1 | v38.84,32.66 38.84,33.16 36.69,35.31 C31.P$2
  Bottom 0.508: L1.2 35.5,14.3 34.3,14.3 | C2.P$1 C3.P$1 C4.P$1 v33.8,14.8 | C13.P$2 35,61.67 | 35,61.67 35,60 | C17.P$2 37.97,61.67 35,61.67 | C22.P$2 42.33,56.9 35,56.9 31.41,56.9 29.9,58.4 | C6.P$2 29.9,58.4 | C10.P$2 27.38,57.2 28.7,57.2 29.9,58.4 | C27.P$1 48.6,48.5 | 48.6,48.5 35,48.5 24.84,48.5 C12.P$2 | 48.6,48.5 47.81,49.29 C25.P$2 | C23.P$1 31.5,44.4 35,44.4 | C30.P$1 32.81,39.4 35,39.4 | C31.P$2 36.03,36 35,36 | 35.01,33.31 35,33.3 | C26.P$1 39.83,38.6 35,38.6 | v68.4,75.7 68.39,75.71 63.65,75.71 62.7,74.76 R10.P$2 | 67.6,88.2 67.6,90.5 66.5,91.6 v64.8,91.6 | J2.P$17 64.84,52.7 68.45,52.7
  Bottom 1.016: L1.2 36.3,13.6 35.1,14.8 v33.8,14.8 34.6,14.8 35,15 35,16.2 | 35,60 35,56.9 35,48.5 35,44.4 35,39.4 35,38.6 35,36 35,33.3 35,16.2 | 35,16.2 66,16.2 68.45,18.65 68.45,52.7 68.45,75.65 v68.4,75.7 68.4,84.9 | 68.4,84.9 68.4,87.4 67.6,88.2 J1.2 | J1.4 67.64,85.66 68.4,84.9
VDD5  (via drill 0.35)
  Top 0.254: R3.P$2 16.1,23.5 15.3,22.7 R2.P$2 15.25,22.25 C8.P$1 C11.P$1 v11.9,22.25
  Top 0.508: 16.5,18.4 U2.4 15.81,19.1 15.81,20.32 15.3,20.82 R2.P$2
  Top 1.016: v68.45,14 68.45,70.7 | 68.45,70.7 68.4,73.2 67.47,74.13 J2.P$2 | J2.P$4 67.51,71.59 68.45,70.7
  Bottom 0.508: J3.P$3 40.12,4.52 38.2,2.6 19,2.6 16.08,5.52 16.08,10.52 11.88,14.72 11.88,22.23 v11.9,22.25
  Bottom 1.016: J3.P$3 40.12,6.38 41.88,4.62 59.02,4.62 v68.45,14
VDDIN
  Bottom 1.27: L1.1 J3.P$2 | J3.P$2 35.5,8.51 35.5,11.2 36.31,10.39 J3.P$2 | J3.P$2 37.6,8.99 37.6,11.2
X_DIR  (1 unrouted)
X_LS  (1 unrouted)
X_STEP  (1 unrouted)
XCIN  (4 unrouted)
  Top 0.2: 18.45,38.51 18.24,38.29
  Top 0.254: U5.20 22.34,39.11 19.05,39.11 X2.P$1
XCOUT  (3 unrouted)
  Top 0.254: U5.21 22.69,38.75 C24.P$1 21.28,37.8 X2.P$2
XTAL1  (3 unrouted)
  Top 0.152: X1.1 21.59,32.53
  Top 0.254: 24.07,37.27 C7.P$1 | 24.56,37.13 24.64,37.2 C7.P$1 | U5.23 24.42,39.07 C7.P$1 | C7.P$1 23.2,37.2 20.5,34.5 20.5,33.63 21.59,32.53
XTAL2  (4 unrouted)
  Top 0.2: 24.56,32.25 X1.3
  Top 0.254: C14.P$1 25.98,33.95 25.98,33.66 X1.3 | C14.P$1 25.91,33.59 | C14.P$1 25.87,33.91 25.87,34.88 25.3,35.44 25.3,39.24 U5.24
Y_DIR  (1 unrouted)
Y_LS  (1 unrouted)
Y_STEP  (1 unrouted)
Z_DIR  (1 unrouted)
Z_LS  (1 unrouted)
Z_STEP  (1 unrouted)

### Text on the board
tNames: 2 | 40 | 1 | 2 | 1 | 39 | 9 | 10 | 1 | 2 | 39 | 40